# Altium schematic sheet RGB LED Shett.SchDoc
size A4; SheetNumber: 1; SheetTotal: 1
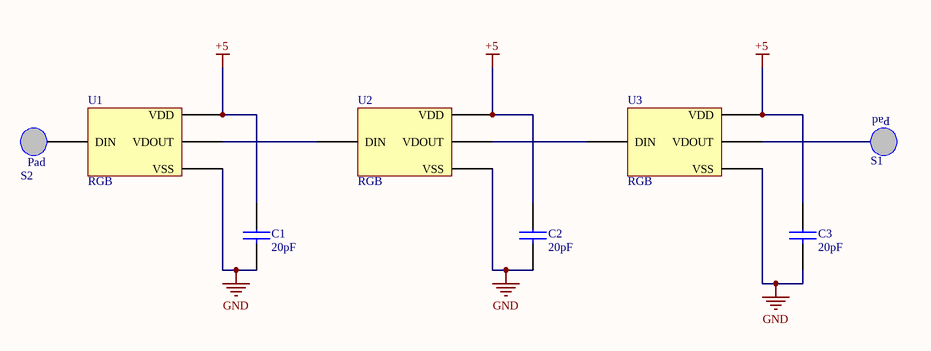
[diagram p0: RGB LED Shett.SchDoc]

## Parts
C1  Capacitance: 20pF  [CAP_0603]  (hidden comment: CL10C200JB8NNNC)
C2  Capacitance: 20pF  [CAP_0603]  (hidden comment: CL10C200JB8NNNC)
C3  Capacitance: 20pF  [CAP_0603]  (hidden comment: CL10C200JB8NNNC)
S1  RGBsolderpad  [Solderpad0]  (value not drawn)
S2  RGBsolderpad  [Solderpad0]  (value not drawn)
U1  RGB  [RGB LED 1655]
U2  RGB  [RGB LED 1655]
U3  RGB  [RGB LED 1655]

## Nets
+5: C1.1 C2.1 C3.1 U1.2(VDD) U2.2(VDD) U3.2(VDD)
GND: C1.2 C2.2 C3.2 U1.4(VSS) U2.4(VSS) U3.4(VSS)
NetS1_1: S1.1 U3.3(VDOUT)
NetS2_1: S2.1 U1.1(DIN)
NetU1_3: U1.3(VDOUT) U2.1(DIN)
NetU2_3: U2.3(VDOUT) U3.1(DIN)

## Notes on the sheet
- (in symbol RGBsolderpad) Pad

## Library data of the parts
C1-C3 = CAP CER 20pF 0603: CAP CER 20pF %5 0603 SMD; Manufacturer: Samsung; Tolerance: 5%; Dielectric: C0G; Voltage Rating: 50V; Temperature Coefficient: 300ppm/°C; Designed by: BERK; Supplier 1: Digi-Key; Manufacturer Part Number: CL10C200JB8NNNC; RoHS: Yes; Category: Ceramic Capacitors; Stock 1: 765558; Pricing 1: 1=0,10000, 10=0,04700, 50=0,02560, 100=0,02090, 500=0,01490, 1000=0,01171 (USD); Mount: Surface Mount; Case/Package: 0603; Case Code (Metric): 1608; Case Code (Imperial): 0603; Min Operating Temperature: -55°C; Max Operating Temperature: 125°C; Package Quantity: 1; Packaging: Tape and Reel; Voltage: 50V; Series: CL; Construction: Flat; Length: 1.6mm; Width: 0.031inch; Height: 0.8mm; Thickness: 0.035inch; Depth: 0.8mm; Radiation Hardening: No; RoHS Compliant: Yes; ComponentLink1URL: https://datasheet.ciiva.com/26877/getdatasheetpartid-640634-26877974.pdf?src-supplier=Verical; ComponentLink1Description: https://datasheet.ciiva.com/26877/getdatasheetpartid-640634-26877974.pdf?src-supplier=Verical; ComponentLink2URL: https://datasheet.ciiva.com/26310/mlcc-catalogdownload2013-eng-26310315.pdf?src-supplier=Distrelec; ComponentLink2Description: https://datasheet.ciiva.com/26310/mlcc-catalogdownload2013-eng-26310315.pdf?src-supplier=Distrelec; Supplier Part Number 1: 1276-1187-1-ND
S1 S2 = RGBsolderpad: SOLDER PAD
U1-U3 = RGB LED 1655: Neopixel 5050 RGB LED with Integrated Driver Chip - 10 Pack; Manufacturer: Adafruit Industries; Manufacturer Part Number: 1655; Number of LEDs: 10; Supplier: Mouser; Supplier Part Number: 485-1655; RoHS: Compliant; Category: LEDs; Stock: 1926; Pricing: 1=4,5, 10=4,5, 50=4,5, 100=4,5, 1000=4,5, 10000=4,5 (USD); Color: Blue, Green, Red; Height: 1.6mm; Length: 5mm; Max Operating Temperature: 85°C; Min Operating Temperature: -40°C; Mounting Technology: Surface Mount; Schedule B: 8541402000, 8542310000, 8542310000|8542310000|8542310000|8542310000|8542310000; Width: 5mm; ComponentLink1URL: https://datasheet.octopart.com:443/1655-Adafruit-Industries-datasheet-130000511.pdf?src-supplier=Upverter; ComponentLink1Description: https://datasheet.octopart.com:443/1655-Adafruit-Industries-datasheet-130000511.pdf?src-supplier=Upverter; ComponentLink2URL: https://datasheet.octopart.com/ADA1655-Adafruit-Industries-datasheet-32028139.pdf; ComponentLink2Description: https://datasheet.octopart.com/ADA1655-Adafruit-Industries-datasheet-32028139.pdf